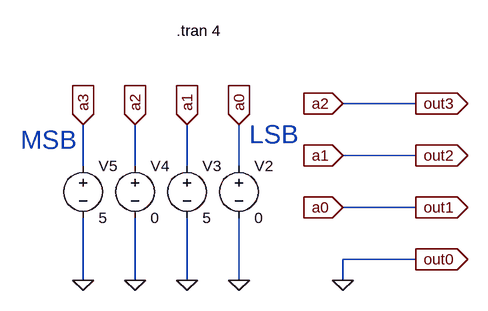
[diagram p0: schematic 4 bit left shift .asc]
4 bit left shift .asc, the LTspice schematic file:
Version 4
SHEET 1 2552 1936
WIRE -576 -448 -688 -448
WIRE -576 -368 -688 -368
WIRE -1088 -352 -1088 -416
WIRE -1008 -352 -1008 -416
WIRE -928 -352 -928 -416
WIRE -848 -352 -848 -416
WIRE -576 -288 -688 -288
WIRE -576 -208 -688 -208
WIRE -1088 -176 -1088 -272
WIRE -1008 -176 -1008 -272
WIRE -928 -176 -928 -272
WIRE -848 -176 -848 -272
WIRE -688 -176 -688 -208
FLAG -848 -176 0
FLAG -848 -416 a0
IOPIN -848 -416 In
FLAG -928 -176 0
FLAG -928 -416 a1
IOPIN -928 -416 In
FLAG -1008 -176 0
FLAG -1008 -416 a2
IOPIN -1008 -416 In
FLAG -1088 -176 0
FLAG -1088 -416 a3
IOPIN -1088 -416 In
FLAG -688 -288 a0
IOPIN -688 -288 In
FLAG -688 -368 a1
IOPIN -688 -368 In
FLAG -688 -448 a2
IOPIN -688 -448 In
FLAG -576 -448 out3
IOPIN -576 -448 Out
FLAG -576 -368 out2
IOPIN -576 -368 Out
FLAG -576 -288 out1
IOPIN -576 -288 Out
FLAG -576 -208 out0
IOPIN -576 -208 Out
FLAG -688 -176 0
SYMBOL voltage -848 -368 R0
SYMATTR InstName V2
SYMATTR Value 0
SYMBOL voltage -928 -368 R0
SYMATTR InstName V3
SYMATTR Value 5
SYMBOL voltage -1008 -368 R0
SYMATTR InstName V4
SYMATTR Value 0
SYMBOL voltage -1088 -368 R0
SYMATTR InstName V5
SYMATTR Value 5
TEXT -944 -560 Left 2 !.tran 4
TEXT -832 -400 Left 4 ;LSB
TEXT -1184 -392 Left 4 ;MSB

The netlist it stands for:
* 4 bit left shift .asc
V2 out1 0 0
V3 out2 0 5
V4 out3 0 0
V5 a3 0 5
.tran 4
* LSB
* MSB
.backanno
.end